# Altium schematic sheet Rus.SchDoc
size 420 x 297 mm; DocumentNumber: 1; SheetNumber: 3; SheetTotal: 3; GPN_PCBA: 650-03253-01
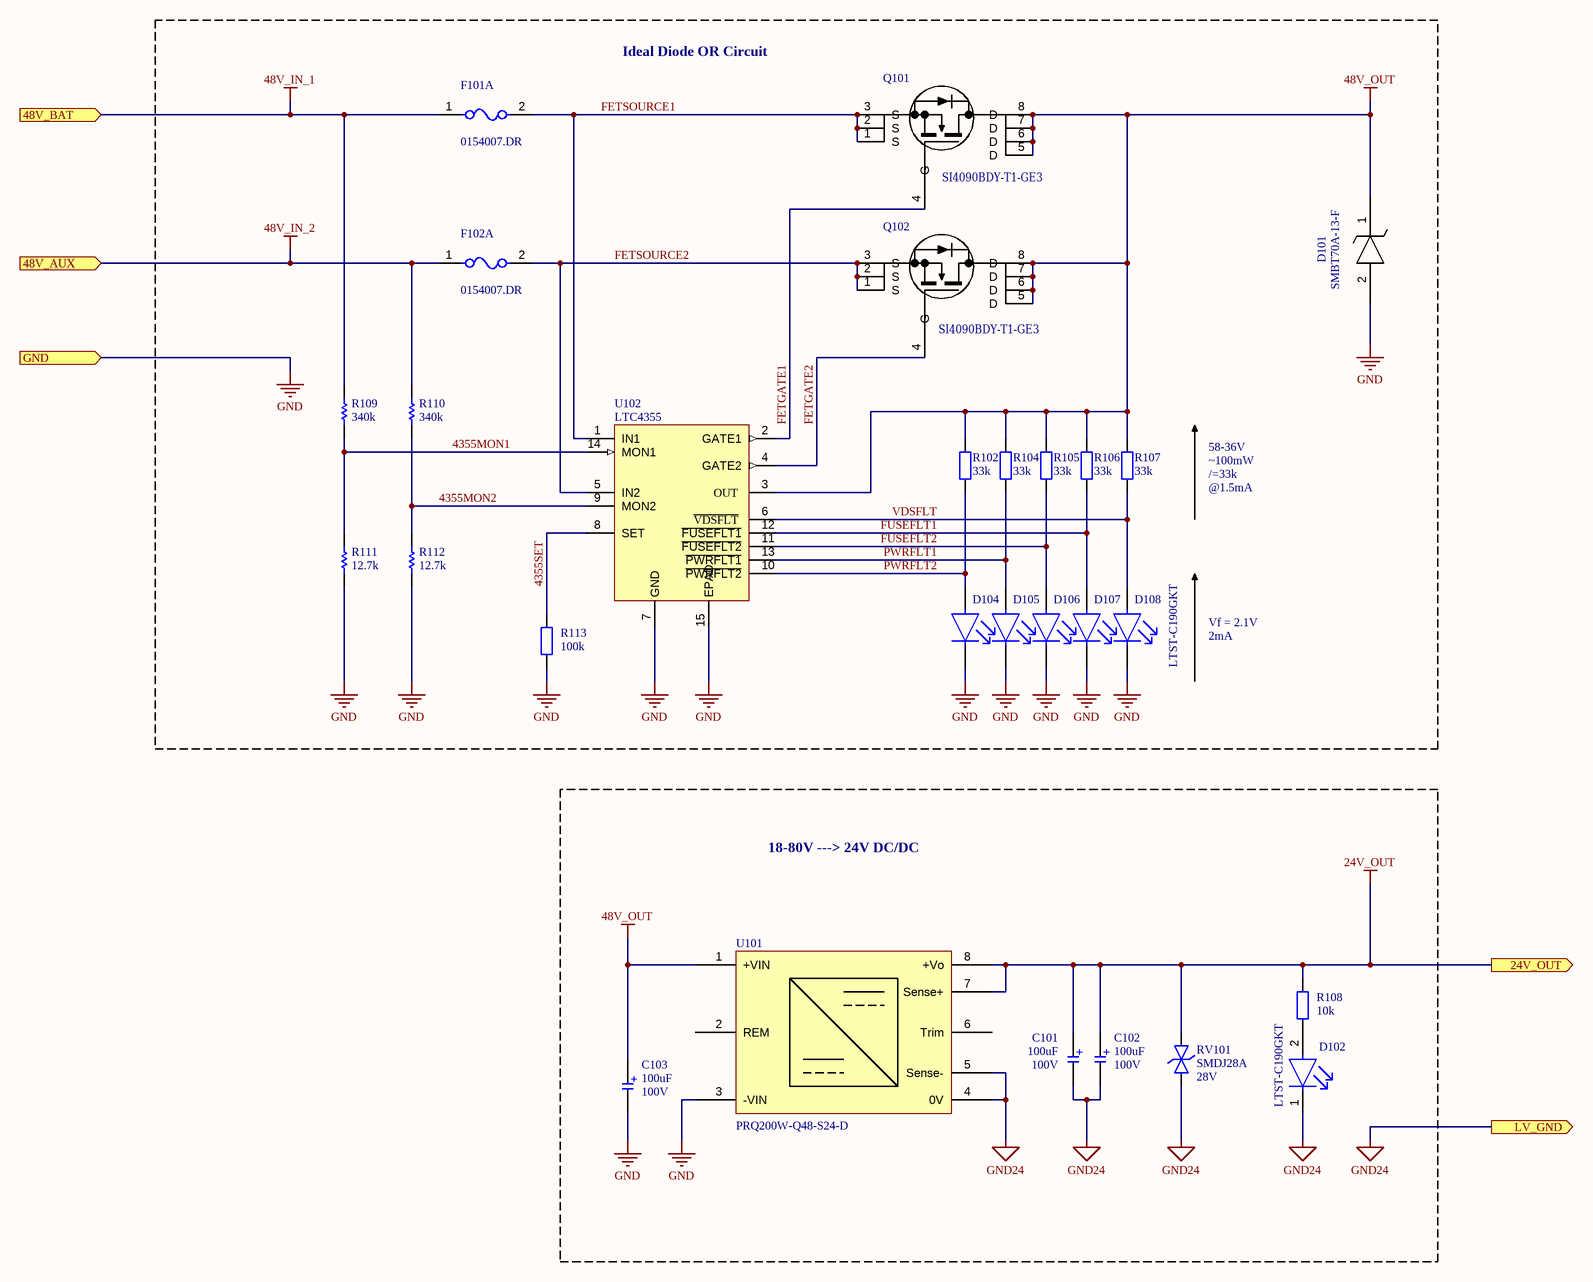
[diagram p0: Rus.SchDoc]

## Parts
C101  Voltage Rating: 100V  Capacitance: 100uF  [CAP ALSMD ELEC 12.5MM H13MM]  (hidden comment: EMVE101ARA101MKE0S)
C102  Voltage Rating: 100V  Capacitance: 100uF  [CAP ALSMD ELEC 12.5MM H13MM]  (hidden comment: EMVE101ARA101MKE0S)
C103  Voltage Rating: 100V  Capacitance: 100uF  [CAP ALSMD ELEC 12.5MM H13MM]  (hidden comment: EMVE101ARA101MKE0S)
D101  SMBT70A-13-F  [SMBT70A-13-F]
D102  LTST-C190GKT  [FP-LTST-C190GKT-MFG]
D104  LTST-C190GKT  [FP-LTST-C190GKT-MFG]  (value not drawn)
D105  LTST-C190GKT  [FP-LTST-C190GKT-MFG]  (value not drawn)
D106  LTST-C190GKT  [FP-LTST-C190GKT-MFG]
D107  LTST-C190GKT  [FP-LTST-C190GKT-MFG]  (value not drawn)
D108  LTST-C190GKT  [FP-LTST-C190GKT-MFG]  (value not drawn)
F101A  0154007.DR  [FP-0154-MFG]
F102A  0154007.DR  [FP-0154-MFG]
Q101  ‎SI4090BDY-T1-GE3‎  [SOIC127P600X175-8N]
Q102  ‎SI4090BDY-T1-GE3‎  [SOIC127P600X175-8N]
R102  33k  [RES 0603_1608 RF]
R104  33k  [RES 0603_1608 RF]
R105  33k  [RES 0603_1608 RF]
R106  33k  [RES 0603_1608 RF]
R107  33k  [RES 0603_1608 RF]
R108  10k  [RES 0402_1005 RF]
R109  Resistance: 340k  [RESC2013X60X40NL20T25]  (hidden comment: ERA6AEB3403V)
R110  Resistance: 340k  [RESC2013X60X40NL20T25]  (hidden comment: ERA6AEB3403V)
R111  Resistance: 12.7k  [RESC1608X55X30LL15T15]  (hidden comment: ERJ-3EKF1272V)
R112  Resistance: 12.7k  [RESC1608X55X30LL15T15]  (hidden comment: ERJ-3EKF1272V)
R113  100k  [RES 0402_1005 RF]
RV101  SMDJ28A  Operating Supply Voltage: 28V  [DO214AB SMC]
U101  PRQ200W-Q48-S24-D  [DIP BRICK QUARTER]
U102  Colloquial: LTC4355  [DFN-14_DE_LIT]  (hidden comment: LTC4355IDE#PBF)

## Blocks framed on the sheet
Ideal Diode OR Circuit: D101 D104-D108 F101A F102A Q101 Q102 R102 R104-R107 R109-R113 U102
18-80V ---> 24V DC/DC: C101-C103 D102 R108 RV101 U101

## Ports
24V_OUT (out), 48V_AUX (in), 48V_BAT (in), GND (in), LV_GND (out)

## Nets
24V_OUT: C101.1 C102.1 R108.2 RV101.2 U101.7(Sense+) U101.8(+Vo) ; port 24V_OUT
48V_IN_1: F101A.1 R109.2 ; port 48V_BAT
48V_IN_2: F102A.1 R110.2 ; port 48V_AUX
48V_OUT: C103.1 D101.1 Q101.5(D) Q101.6(D) Q101.7(D) Q101.8(D) Q102.5(D) Q102.6(D) Q102.7(D) Q102.8(D) R102.2 R104.2 R105.2 R106.2 R107.2 U101.1(+VIN) U102.3(OUT)
GND: C103.2 D101.2 D104.1(C) D105.1(C) D106.1(C) D107.1(C) D108.1(C) R111.1 R112.1 R113.1 U101.3(-VIN) U102.7(GND) U102.15(EPAD) ; port GND
GND24: C101.2 C102.2 D102.1(C) RV101.1 U101.4(0V) U101.5(Sense-) ; port LV_GND
4355MON1: R109.1 R111.2 U102.14(MON1)
4355MON2: R110.1 R112.2 U102.9(MON2)
4355SET: R113.2 U102.8(SET)
FETGATE1: Q101.4(G) U102.2(GATE1)
FETGATE2: Q102.4(G) U102.4(GATE2)
FETSOURCE1: F101A.2 Q101.1(S) Q101.2(S) Q101.3(S) U102.1(IN1)
FETSOURCE2: F102A.2 Q102.1(S) Q102.2(S) Q102.3(S) U102.5(IN2)
FUSEFLT1: D107.2(A) R106.1 U102.12(~{FUSEFLT1})
FUSEFLT2: D106.2(A) R105.1 U102.11(~{FUSEFLT2})
PWRFLT1: D105.2(A) R104.1 U102.13(~{PWRFLT1})
PWRFLT2: D104.2(A) R102.1 U102.10(~{PWRFLT2})
VDSFLT: D108.2(A) R107.1 U102.6(~{VDSFLT})
NetD102_2: D102.2(A) R108.1

Not connected (* = marked no-connect by the designer): U101 2(REM) 6(Trim)

## Notes on the sheet
- 58-36V
  ~100mW
  /=33k
  @1.5mA
- Vf = 2.1V
  2mA
- CREATIVE COMMONS
- PUBLIC LICENSE:
- BARKOUR ROBOT
- CC BY-NC 4.0
- APPROVED
- DWG NO
- GOOGLE LLC
- FILE
- RELEASED
- 2024/05/09
- SIZE
- 1600 AMPHITHEATRE PARKWAY
- MOUNTAIN VIEW CA 94043
- A3
- SHEET
- OF
- THIS DESIGN IS BEING PROVIDED  FOR NON-COMMERCIAL USE ONLY. THE USE OF =SCIENTIST_NAME_POSSESSIVE NAME IN CONNECTION WITH THE DESIGN IS NOT INTENDED TO IMPLY THAT =SCIENTIST_NAME SPONSORS OR ENDORSES THE DESIGN, GOOGLE LLC, OR ANY OF GOOGLE LLC'S PRODUCTS OR SERVICES.
- (in symbol C_POL) +

## Library data of the parts
C101-C103 = C_POL: Generic Polarised Capacitor; Manufacturer: United Chemi-Con; Tolerance: 20%; Diameter: 12.5mm; Height: 13.5mm; Size Code: D12.5 x H13.5; Manufacturer Part Number: EMVE101ARA101MKE0S
D101 = SMBT70A-13-F: SMBJ Series 70 V 600 W Surface Mount Uni-Directional TVS Diode - DO-214AA; Manufacturer: Diodes; Number of Terminals/Pins: 2; Package Body Material: Plastic; Diode Element Material: SILICON; Reverse Standoff Voltage: 70V; Clamping Voltage: 100V; Peak Pulse Power: 600W; Peak Pulse Current: 5.3A; Test Current: 1mA; Reverse Breakdown Voltage: 77.8V; Max Surge Current: 100A; Number of Elements: 1; Polarity: Unidirectional; Leakage Current: 5uA; Power Line Protection: No; Element Configuration: Single; Diode Type: ZENER; Max Breakdown Voltage: 89.5V; Forward Voltage: 3.5V; Capacitance: 290pF; Time @ Peak Reflow Temperature-Max (s): 30s; Supplier 1: Digi-Key; Manufacturer Part Number: SMBT70A-13-F; Stock 1: 0; Pricing 1: 1 = 0.66000, 10 = 0.56300, 100 = 0.42040, 500 = 0.33032, 1000 = 0.25526 (USD); RoHS: Yes; Mount: Surface Mount; Case/Package: SMB; Number of Pins: 2; Contact Plating: Tin,Matte; Terminal Finish: Tin; Package Shape: Rectangular; Min Operating Temperature: -55°C; Max Operating Temperature: 150°C; Package Quantity: 3000; Packaging: Tape and Reel; Min Breakdown Voltage: 77.8V; Breakdown Voltage: 77.8V; Termination: SMD/SMT; Working Voltage: 70V; Max Power Dissipation: 600W; Series: Automotive, AEC-Q101; Direction: Unidirectional; Number of Unidirectional Channels: 1; Max Reverse Leakage Current: 5uA; Resistor Type: Zener; Power Dissipation: 600W; ESD Protection: No; Clamping Voltage-Max: 100V; Max Output Current: 5.3A; Moisture Sensitivity Level: 1; JESD-30 Code: R-PDSO-C2; Surface Mount: Yes; Terminal Position: DUAL; Technology: AVALANCHE; Peak Reflow Temperature (Cel): 260°C; Terminal Form: C BEND; Length: 3.94mm; Width: 4.57mm; Height: 2.62mm; Radiation Hardening: No; RoHS Compliant: Yes; Lead Free: Lead Free; ComponentLink1URL: https://datasheet.ciiva.com/341/ds30213-341009.pdf?src-supplier=Digi-Key; ComponentLink1Description: https://datasheet.ciiva.com/341/ds30213-341009.pdf?src-supplier=Digi-Key; ComponentLink2URL: https://datasheet.ciiva.com/4511/ds30213-70999-4511094.pdf?src-supplier=Mouser; ComponentLink2Description: https://datasheet.ciiva.com/4511/ds30213-70999-4511094.pdf?src-supplier=Mouser; ComponentLink3URL: https://datasheet.ciiva.com/34302/1542506-34302445.pdf?src-supplier=Jameco; ComponentLink3Description: https://datasheet.ciiva.com/34302/1542506-34302445.pdf?src-supplier=Jameco; ComponentLink4URL: https://datasheet.ciiva.com/16487/ds30213-16487738.pdf?src-supplier=Future+Electronics; ComponentLink4Description: https://datasheet.ciiva.com/16487/ds30213-16487738.pdf?src-supplier=Future+Electronics; ComponentLink5URL: https://datasheet.ciiva.com/17412/ds30213-17412667.pdf?src-supplier=Avnet+Europe; ComponentLink5Description: https://datasheet.ciiva.com/17412/ds30213-17412667.pdf?src-supplier=Avnet+Europe; ComponentLink6URL: https://datasheet.ciiva.com/3021/ds30213-3021468.pdf?src-supplier=Avnet; ComponentLink6Description: https://datasheet.ciiva.com/3021/ds30213-3021468.pdf?src-supplier=Avnet; Supplier Part Number 1: SMBT70A-13-FDICT-ND
D102 D104-D108 = CMP-22017-000005-2: LED GREEN CLEAR CHIP SMD; Dominant Wavelength: 569nm; Reverse Voltage: 5V; Lens Color: Colorless; Viewing Angle: 130°; Voltage: 2V; Forward Current: 30mA; Power Dissipation: 100mW; Luminous Intensity: 6mcd; Number of LEDs: 1; Forward Voltage: 2.1V; Wavelength: 565nm; Test Current: 10mA; Min Operating Temperature: -55°C; Lens Style: Clear; Mount: Surface Mount; Width: 0.8mm; Packaging: Tape and Reel; Lens Transparency: Clear; Case Code (Metric): 1608; Depth: 0.8mm; Case Code (Imperial): 0603; Case/Package: 0603; Number of Pins: 2; Max Operating Temperature: 85°C; Lead Free: Lead Free; Number of Elements: 1; Length: 1.6mm; Height: 0.8mm; Package Quantity: 1; Power Rating: 100mW; Radiation Hardening: No; Illumination Color: Green; Color: Green
F101A F102A = CMP-08605-000035-1: FUSE BRD MNT 7A 125VAC/VDC 2SMD; Manufacturer: Littelfuse Inc; Max Fuse Ac Voltage: 125V; Fuse Blow Speed: Fast; Manufacturer Part Number: 0154007.DR; Device Class L1: Circuit Protection; Octopart: https://octopart.com/0154007.dr-littelfuse-565863; RoHS: TRUE; Automotive: No; Category: Fuse; Device Class L3: unset; Fuse Current: 7A; Device Class L2: Fuses; Height: 3.81mm; Temperature: -55°C to +125°C; ComponentLink2URL: https://www.littelfuse.com/~/media/electronics/datasheets/fuses/littelfuse_fuse_154_154t_154l_154tl_datasheet.pdf.pdf; Digikey Description: FUSE BRD MNT 7A 125VAC/VDC 2SMD; Package: 0154; Max Fuse Dc Voltage: 125V; Temperature Range High: +125°C; Lead Free: Yes; ComponentLink2Description: Datasheet; Mouser Description: Surface Mount Fuses Fuseblock w/ fuse 7A OMNI BLOK 154; Temperature Range Low: -55°C
R102 R104-R107 = R: Generic Resistor; Tolerance: 1%; Voltage Rating: 75V; Power Rating: 100mW; Temperature Coefficient: 100ppm/°C; Size Code: 0603; Resistance: 33k
R108 R113 = R: Generic Resistor; Tolerance: 1%; Voltage Rating: 50V; Power Rating: 62.5mW; Temperature Coefficient: 100ppm/°C; Size Code: 0402
  R108: Resistance: 10k
  R113: Resistance: 100k
R109 R110 = CMP-2001-00804-1: Manufacturer: Panasonic; Part Number: ERA6AEB3403V
R111 R112 = CMP-2000-00228-1: Manufacturer: Panasonic; Part Number: ERJ-3EKF1272V
RV101 = SMDJ28A: J Series 31.1 V 3000 W Surface Mount Uni-Directional TVS Diode - DO-214AB; Manufacturer: Littelfuse; Number of Unidirectional Channels: 1; Min Breakdown Voltage: 31.1V; Clamping Voltage: 45.4V; Peak Pulse Power: 3kW; Power Line Protection: No; Peak Pulse Current: 66.1A; Polarity: Unidirectional; Test Current: 1mA; Leakage Current: 2uA; Diode Type: ZENER; Max Breakdown Voltage: 34.4V; Manufacturer Part Number: SMDJ28A; Supplier 1: RSComponents; RoHS: Yes; Category: TVS Diodes; Stock 1: 1220; Pricing 1: 50=0.71100, 100=0.63100, 500=0.59100, 1000=0.53600 (GBP); Mount: Surface Mount; Case/Package: DO-214AB; Number of Pins: 2; Min Operating Temperature: -55°C; Max Operating Temperature: 150°C; Reverse Standoff Voltage: 28V; Resistor Type: Zener; Packaging: Tape and Reel; Package Quantity: 3000; Reverse Breakdown Voltage: 31.1V; Number of Elements: 1; Series: SMDJ; Max Surge Current: 66.1A; Number of Channels: 1; Breakdown Voltage: 31.1V; Termination: SMD/SMT; Direction: Unidirectional; Power Dissipation: 3kW; Clamping Voltage-Max: 45.4V; RoHS Compliant: Yes; REACH SVHC: No SVHC; Lead Free: Lead Free; ComponentLink1URL: https://datasheet.ciiva.com/332/littelfuse-tvs-diode-smdj-datasheet-pdf-332693.pdf?src-supplier=Digi-Key; ComponentLink1Description: https://datasheet.ciiva.com/332/littelfuse-tvs-diode-smdj-datasheet-pdf-332693.pdf?src-supplier=Digi-Key; ComponentLink2URL: https://datasheet.ciiva.com/332/littelfuse-tvs-diode-smdj-datasheet-pdf-332694.pdf?src-supplier=Digi-Key; ComponentLink2Description: https://datasheet.ciiva.com/332/littelfuse-tvs-diode-smdj-datasheet-pdf-332694.pdf?src-supplier=Digi-Key; ComponentLink3URL: https://datasheet.ciiva.com/332/littelfuse-tvs-diode-smdj-datasheet-pdf-332695.pdf?src-supplier=Digi-Key; ComponentLink3Description: https://datasheet.ciiva.com/332/littelfuse-tvs-diode-smdj-datasheet-pdf-332695.pdf?src-supplier=Digi-Key; ComponentLink4URL: https://datasheet.ciiva.com/4508/littelfuse-tvs-diode-smdj-datasheet-pdf-4508137.pdf?src-supplier=Mouser; ComponentLink4Description: https://datasheet.ciiva.com/4508/littelfuse-tvs-diode-smdj-datasheet-pdf-4508137.pdf?src-supplier=Mouser; Supplier Part Number 1: 1714200P
U101 = PRQ200W-Q48-S24-D: 24 Vdc, 8.4 A, 201.6 W, 18~75 Vdc Input Range; Manufacturer: CUI Inc; Manufacturer Part Number: PRQ200W-Q48-S24-D; Supplier 1: Farnell; RoHS: No; Category: Board Mount Modules; Stock 1: 10; Pricing 1: 1=115.34000 (GBP); Supplier Part Number 1: 3873074; ComponentLink1Description: Datasheet; ComponentLink1URL: https://www.cui.com/product/resource/prq200w.pdf
U102 = LTC4355IDE#PBF: Positive High Voltage Ideal Diode-OR with Input Supply and Fuse Monitors IC OR CTRLR SRC SELECT 14DFN; Manufacturer: Analog Devices; Number of Outputs: 2; Manufacturer Part Number: LTC4355IDE#PBF; Supplier 1: Mouser; RoHS: Yes; Category: Power Management ICs; Stock 1: 5334; Pricing 1: 1=9.21000, 10=8.31000, 50=7.92000, 100=6.88000, 1000=5.99000, 10000=5.47000 (USD); Case/Package: DFN EP; Number of Pins: 14; Min Operating Temperature: -40°C; Max Operating Temperature: 85°C; Package Quantity: 91; Series: -; Length: 4mm; Radiation Hardening: No; Lead Free: Lead Free; RoHS Compliant: Yes; ComponentLink1URL: https://datasheet.ciiva.com/15104/getdatasheetpartid-365860-15104228.pdf?src-supplier=Verical; ComponentLink1Description: https://datasheet.ciiva.com/15104/getdatasheetpartid-365860-15104228.pdf?src-supplier=Verical; ComponentLink2URL: https://datasheet.ciiva.com/1960/24936-1960774.pdf?src-supplier=Digi-Key; ComponentLink2Description: https://datasheet.ciiva.com/1960/24936-1960774.pdf?src-supplier=Digi-Key; Supplier Part Number 1: 584-LTC4355IDE#PBF
Q101 Q102 = ‎SI4090BDY-T1-GE3‎: ComponentLink1Description: New link; ComponentLink1URL: *; Supplier 1: Digi-Key; Supplier Part Number 1: 742-SI4090BDY-T1-GE3CT-ND; Manufacturer Part Number: SI4090BDY-T1-GE3